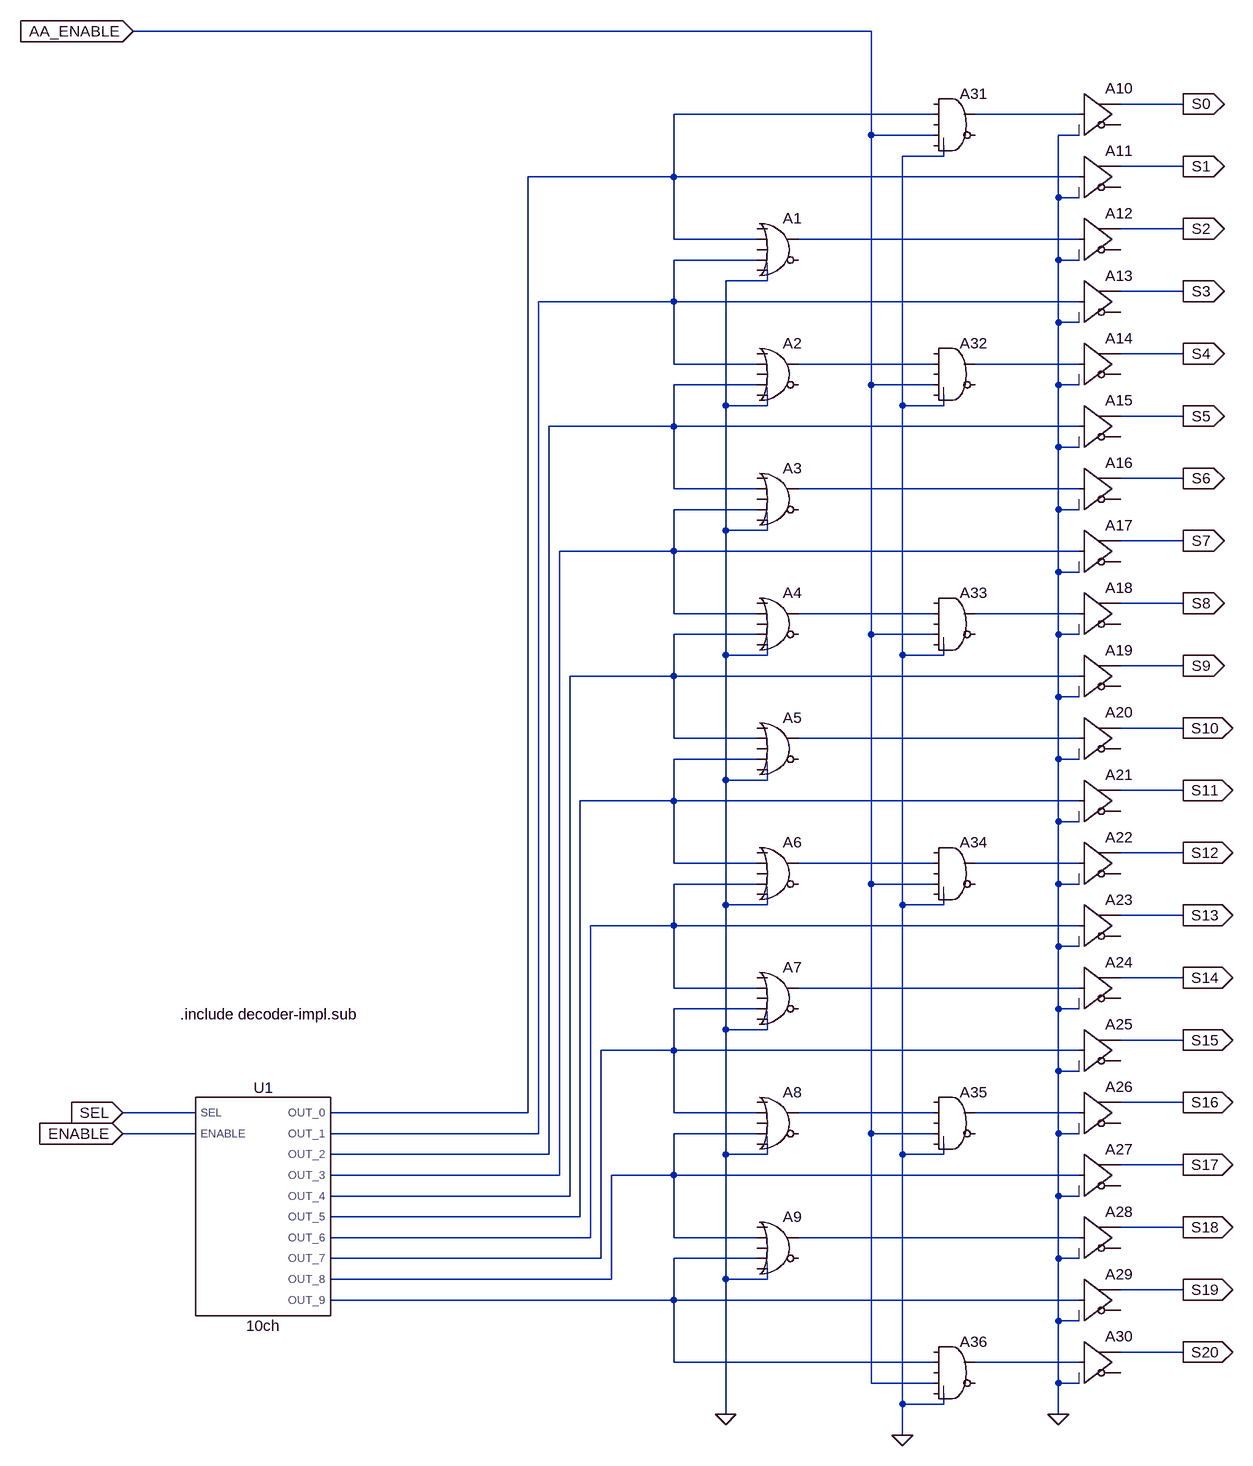
[diagram p0: schematic Selector.asc]
Selector.asc, the LTspice schematic file:
Version 4
SHEET 1 1768 1444
WIRE 1184 -896 48 -896
WIRE 1664 -784 1568 -784
WIRE 1280 -768 880 -768
WIRE 1504 -768 1344 -768
WIRE 1184 -736 1184 -896
WIRE 1280 -736 1184 -736
WIRE 1504 -736 1472 -736
WIRE 1296 -704 1296 -720
WIRE 1296 -704 1232 -704
WIRE 1664 -688 1568 -688
WIRE 880 -672 880 -768
WIRE 880 -672 656 -672
WIRE 1504 -672 880 -672
WIRE 1472 -640 1472 -736
WIRE 1504 -640 1472 -640
WIRE 1664 -592 1568 -592
WIRE 880 -576 880 -672
WIRE 1008 -576 880 -576
WIRE 1504 -576 1072 -576
WIRE 1008 -544 880 -544
WIRE 1472 -544 1472 -640
WIRE 1504 -544 1472 -544
WIRE 1024 -512 1024 -528
WIRE 1024 -512 960 -512
WIRE 1664 -496 1568 -496
WIRE 880 -480 880 -544
WIRE 880 -480 672 -480
WIRE 1504 -480 880 -480
WIRE 1472 -448 1472 -544
WIRE 1504 -448 1472 -448
WIRE 1664 -400 1568 -400
WIRE 880 -384 880 -480
WIRE 1008 -384 880 -384
WIRE 1280 -384 1072 -384
WIRE 1504 -384 1344 -384
WIRE 1008 -352 880 -352
WIRE 1184 -352 1184 -736
WIRE 1280 -352 1184 -352
WIRE 1472 -352 1472 -448
WIRE 1504 -352 1472 -352
WIRE 960 -320 960 -512
WIRE 1024 -320 1024 -336
WIRE 1024 -320 960 -320
WIRE 1232 -320 1232 -704
WIRE 1296 -320 1296 -336
WIRE 1296 -320 1232 -320
WIRE 1664 -304 1568 -304
WIRE 880 -288 880 -352
WIRE 880 -288 688 -288
WIRE 1504 -288 880 -288
WIRE 1472 -256 1472 -352
WIRE 1504 -256 1472 -256
WIRE 1664 -208 1568 -208
WIRE 880 -192 880 -288
WIRE 1008 -192 880 -192
WIRE 1504 -192 1072 -192
WIRE 1008 -160 880 -160
WIRE 1472 -160 1472 -256
WIRE 1504 -160 1472 -160
WIRE 960 -128 960 -320
WIRE 1024 -128 1024 -144
WIRE 1024 -128 960 -128
WIRE 1664 -112 1568 -112
WIRE 880 -96 880 -160
WIRE 880 -96 704 -96
WIRE 1504 -96 880 -96
WIRE 1472 -64 1472 -160
WIRE 1504 -64 1472 -64
WIRE 1664 -16 1568 -16
WIRE 880 0 880 -96
WIRE 1008 0 880 0
WIRE 1280 0 1072 0
WIRE 1504 0 1344 0
WIRE 1008 32 880 32
WIRE 1184 32 1184 -352
WIRE 1280 32 1184 32
WIRE 1472 32 1472 -64
WIRE 1504 32 1472 32
WIRE 960 64 960 -128
WIRE 1024 64 1024 48
WIRE 1024 64 960 64
WIRE 1232 64 1232 -320
WIRE 1296 64 1296 48
WIRE 1296 64 1232 64
WIRE 1664 80 1568 80
WIRE 880 96 880 32
WIRE 880 96 720 96
WIRE 1504 96 880 96
WIRE 1472 128 1472 32
WIRE 1504 128 1472 128
WIRE 1664 176 1568 176
WIRE 880 192 880 96
WIRE 1008 192 880 192
WIRE 1504 192 1072 192
WIRE 1008 224 880 224
WIRE 1472 224 1472 128
WIRE 1504 224 1472 224
WIRE 960 256 960 64
WIRE 1024 256 1024 240
WIRE 1024 256 960 256
WIRE 1664 272 1568 272
WIRE 880 288 880 224
WIRE 880 288 736 288
WIRE 1504 288 880 288
WIRE 1472 320 1472 224
WIRE 1504 320 1472 320
WIRE 1664 368 1568 368
WIRE 880 384 880 288
WIRE 1008 384 880 384
WIRE 1280 384 1072 384
WIRE 1504 384 1344 384
WIRE 1008 416 880 416
WIRE 1184 416 1184 32
WIRE 1280 416 1184 416
WIRE 1472 416 1472 320
WIRE 1504 416 1472 416
WIRE 960 448 960 256
WIRE 1024 448 1024 432
WIRE 1024 448 960 448
WIRE 1232 448 1232 64
WIRE 1296 448 1296 432
WIRE 1296 448 1232 448
WIRE 1664 464 1568 464
WIRE 880 480 880 416
WIRE 880 480 752 480
WIRE 1504 480 880 480
WIRE 1472 512 1472 416
WIRE 1504 512 1472 512
WIRE 1664 560 1568 560
WIRE 880 576 880 480
WIRE 1008 576 880 576
WIRE 1504 576 1072 576
WIRE 1008 608 880 608
WIRE 1472 608 1472 512
WIRE 1504 608 1472 608
WIRE 960 640 960 448
WIRE 1024 640 1024 624
WIRE 1024 640 960 640
WIRE 1664 656 1568 656
WIRE 880 672 880 608
WIRE 880 672 768 672
WIRE 1504 672 880 672
WIRE 1472 704 1472 608
WIRE 1504 704 1472 704
WIRE 1664 752 1568 752
WIRE 144 768 32 768
WIRE 656 768 656 -672
WIRE 656 768 352 768
WIRE 880 768 880 672
WIRE 1008 768 880 768
WIRE 1280 768 1072 768
WIRE 1504 768 1344 768
WIRE 144 800 32 800
WIRE 672 800 672 -480
WIRE 672 800 352 800
WIRE 1008 800 880 800
WIRE 1184 800 1184 416
WIRE 1280 800 1184 800
WIRE 1472 800 1472 704
WIRE 1504 800 1472 800
WIRE 688 832 688 -288
WIRE 688 832 352 832
WIRE 960 832 960 640
WIRE 1024 832 1024 816
WIRE 1024 832 960 832
WIRE 1232 832 1232 448
WIRE 1296 832 1296 816
WIRE 1296 832 1232 832
WIRE 1664 848 1568 848
WIRE 704 864 704 -96
WIRE 704 864 352 864
WIRE 880 864 880 800
WIRE 880 864 784 864
WIRE 1504 864 880 864
WIRE 720 896 720 96
WIRE 720 896 352 896
WIRE 1472 896 1472 800
WIRE 1504 896 1472 896
WIRE 736 928 736 288
WIRE 736 928 352 928
WIRE 1664 944 1568 944
WIRE 752 960 752 480
WIRE 752 960 352 960
WIRE 880 960 880 864
WIRE 1008 960 880 960
WIRE 1504 960 1072 960
WIRE 768 992 768 672
WIRE 768 992 352 992
WIRE 1008 992 880 992
WIRE 1472 992 1472 896
WIRE 1504 992 1472 992
WIRE 784 1024 784 864
WIRE 784 1024 352 1024
WIRE 960 1024 960 832
WIRE 1024 1024 1024 1008
WIRE 1024 1024 960 1024
WIRE 1664 1040 1568 1040
WIRE 880 1056 880 992
WIRE 880 1056 352 1056
WIRE 1504 1056 880 1056
WIRE 1472 1088 1472 992
WIRE 1504 1088 1472 1088
WIRE 1664 1136 1568 1136
WIRE 880 1152 880 1056
WIRE 1280 1152 880 1152
WIRE 1504 1152 1344 1152
WIRE 1184 1184 1184 800
WIRE 1280 1184 1184 1184
WIRE 1472 1184 1472 1088
WIRE 1504 1184 1472 1184
WIRE 1232 1216 1232 832
WIRE 1296 1216 1296 1200
WIRE 1296 1216 1232 1216
WIRE 960 1232 960 1024
WIRE 1472 1232 1472 1184
WIRE 1232 1264 1232 1216
FLAG 1664 -784 S0
IOPIN 1664 -784 Out
FLAG 1664 -688 S1
IOPIN 1664 -688 Out
FLAG 1664 -592 S2
IOPIN 1664 -592 Out
FLAG 1664 -496 S3
IOPIN 1664 -496 Out
FLAG 1664 -400 S4
IOPIN 1664 -400 Out
FLAG 1664 -304 S5
IOPIN 1664 -304 Out
FLAG 1664 80 S9
IOPIN 1664 80 Out
FLAG 1664 176 S10
IOPIN 1664 176 Out
FLAG 1664 272 S11
IOPIN 1664 272 Out
FLAG 1664 368 S12
IOPIN 1664 368 Out
FLAG 1664 464 S13
IOPIN 1664 464 Out
FLAG 1664 560 S14
IOPIN 1664 560 Out
FLAG 1664 656 S15
IOPIN 1664 656 Out
FLAG 1664 752 S16
IOPIN 1664 752 Out
FLAG 1664 848 S17
IOPIN 1664 848 Out
FLAG 1664 944 S18
IOPIN 1664 944 Out
FLAG 1664 1040 S19
IOPIN 1664 1040 Out
FLAG 1664 1136 S20
IOPIN 1664 1136 Out
FLAG 960 1232 0
FLAG 1472 1232 0
FLAG 1664 -208 S6
IOPIN 1664 -208 Out
FLAG 1664 -112 S7
IOPIN 1664 -112 Out
FLAG 1664 -16 S8
IOPIN 1664 -16 Out
FLAG 32 800 ENABLE
IOPIN 32 800 In
FLAG 32 768 SEL
IOPIN 32 768 In
FLAG 48 -896 AA_ENABLE
IOPIN 48 -896 In
FLAG 1232 1264 0
SYMBOL decoder-10ch 240 912 R0
SYMATTR InstName U1
SYMBOL Digital\\or 1040 -624 R0
SYMATTR InstName A1
SYMBOL Digital\\or 1040 -432 R0
SYMATTR InstName A2
SYMBOL Digital\\or 1040 -240 R0
SYMATTR InstName A3
SYMBOL Digital\\or 1040 -48 R0
SYMATTR InstName A4
SYMBOL Digital\\or 1040 144 R0
SYMATTR InstName A5
SYMBOL Digital\\or 1040 336 R0
SYMATTR InstName A6
SYMBOL Digital\\or 1040 528 R0
SYMATTR InstName A7
SYMBOL Digital\\or 1040 720 R0
SYMATTR InstName A8
SYMBOL Digital\\or 1040 912 R0
SYMATTR InstName A9
SYMBOL Digital\\buf 1504 -832 R0
SYMATTR InstName A10
SYMBOL Digital\\buf 1504 -736 R0
SYMATTR InstName A11
SYMBOL Digital\\buf 1504 -640 R0
SYMATTR InstName A12
SYMBOL Digital\\buf 1504 -544 R0
SYMATTR InstName A13
SYMBOL Digital\\buf 1504 -448 R0
SYMATTR InstName A14
SYMBOL Digital\\buf 1504 -352 R0
SYMATTR InstName A15
SYMBOL Digital\\buf 1504 -256 R0
SYMATTR InstName A16
SYMBOL Digital\\buf 1504 -160 R0
SYMATTR InstName A17
SYMBOL Digital\\buf 1504 -64 R0
SYMATTR InstName A18
SYMBOL Digital\\buf 1504 32 R0
SYMATTR InstName A19
SYMBOL Digital\\buf 1504 128 R0
SYMATTR InstName A20
SYMBOL Digital\\buf 1504 224 R0
SYMATTR InstName A21
SYMBOL Digital\\buf 1504 320 R0
SYMATTR InstName A22
SYMBOL Digital\\buf 1504 416 R0
SYMATTR InstName A23
SYMBOL Digital\\buf 1504 512 R0
SYMATTR InstName A24
SYMBOL Digital\\buf 1504 608 R0
SYMATTR InstName A25
SYMBOL Digital\\buf 1504 704 R0
SYMATTR InstName A26
SYMBOL Digital\\buf 1504 800 R0
SYMATTR InstName A27
SYMBOL Digital\\buf 1504 896 R0
SYMATTR InstName A28
SYMBOL Digital\\buf 1504 992 R0
SYMATTR InstName A29
SYMBOL Digital\\buf 1504 1088 R0
SYMATTR InstName A30
SYMBOL Digital\\and 1312 -816 R0
SYMATTR InstName A31
SYMBOL Digital\\and 1312 -432 R0
SYMATTR InstName A32
SYMBOL Digital\\and 1312 -48 R0
SYMATTR InstName A33
SYMBOL Digital\\and 1312 336 R0
SYMATTR InstName A34
SYMBOL Digital\\and 1312 720 R0
SYMATTR InstName A35
SYMBOL Digital\\and 1312 1104 R0
SYMATTR InstName A36
TEXT 120 616 Left 2 !.include decoder-impl.sub

The netlist it stands for:
* Selector.asc
XU1 SEL ENABLE N001 N004 N007 N009 N012 N014 N017 N019 N022 N024 decoder-10ch  ; pins SEL ENABLE OUT_0 OUT_1 OUT_2 OUT_3 OUT_4 OUT_5 OUT_6 OUT_7 OUT_8 OUT_9
A1 0 N001 0 N004 0 0 N003 0 OR
A2 0 N004 0 N007 0 0 N005 0 OR
A3 0 N007 0 N009 0 0 N008 0 OR
A4 0 N009 0 N012 0 0 N010 0 OR
A5 0 N012 0 N014 0 0 N013 0 OR
A6 0 N014 0 N017 0 0 N015 0 OR
A7 0 N017 0 N019 0 0 N018 0 OR
A8 0 N019 0 N022 0 0 N020 0 OR
A9 0 N022 0 N024 0 0 N023 0 OR
A10 N002 0 0 0 0 0 S0 0 BUF
A11 N001 0 0 0 0 0 S1 0 BUF
A12 N003 0 0 0 0 0 S2 0 BUF
A13 N004 0 0 0 0 0 S3 0 BUF
A14 N006 0 0 0 0 0 S4 0 BUF
A15 N007 0 0 0 0 0 S5 0 BUF
A16 N008 0 0 0 0 0 S6 0 BUF
A17 N009 0 0 0 0 0 S7 0 BUF
A18 N011 0 0 0 0 0 S8 0 BUF
A19 N012 0 0 0 0 0 S9 0 BUF
A20 N013 0 0 0 0 0 S10 0 BUF
A21 N014 0 0 0 0 0 S11 0 BUF
A22 N016 0 0 0 0 0 S12 0 BUF
A23 N017 0 0 0 0 0 S13 0 BUF
A24 N018 0 0 0 0 0 S14 0 BUF
A25 N019 0 0 0 0 0 S15 0 BUF
A26 N021 0 0 0 0 0 S16 0 BUF
A27 N022 0 0 0 0 0 S17 0 BUF
A28 N023 0 0 0 0 0 S18 0 BUF
A29 N024 0 0 0 0 0 S19 0 BUF
A30 N025 0 0 0 0 0 S20 0 BUF
A31 0 N001 0 AA_ENABLE 0 0 N002 0 AND
A32 0 N005 0 AA_ENABLE 0 0 N006 0 AND
A33 0 N010 0 AA_ENABLE 0 0 N011 0 AND
A34 0 N015 0 AA_ENABLE 0 0 N016 0 AND
A35 0 N020 0 AA_ENABLE 0 0 N021 0 AND
A36 0 N024 0 AA_ENABLE 0 0 N025 0 AND
.include decoder-impl.sub
.lib decoder-impl.sub
.backanno
.end